# Altium schematic sheet 11 MISC.SchDoc
size 420 x 297 mm
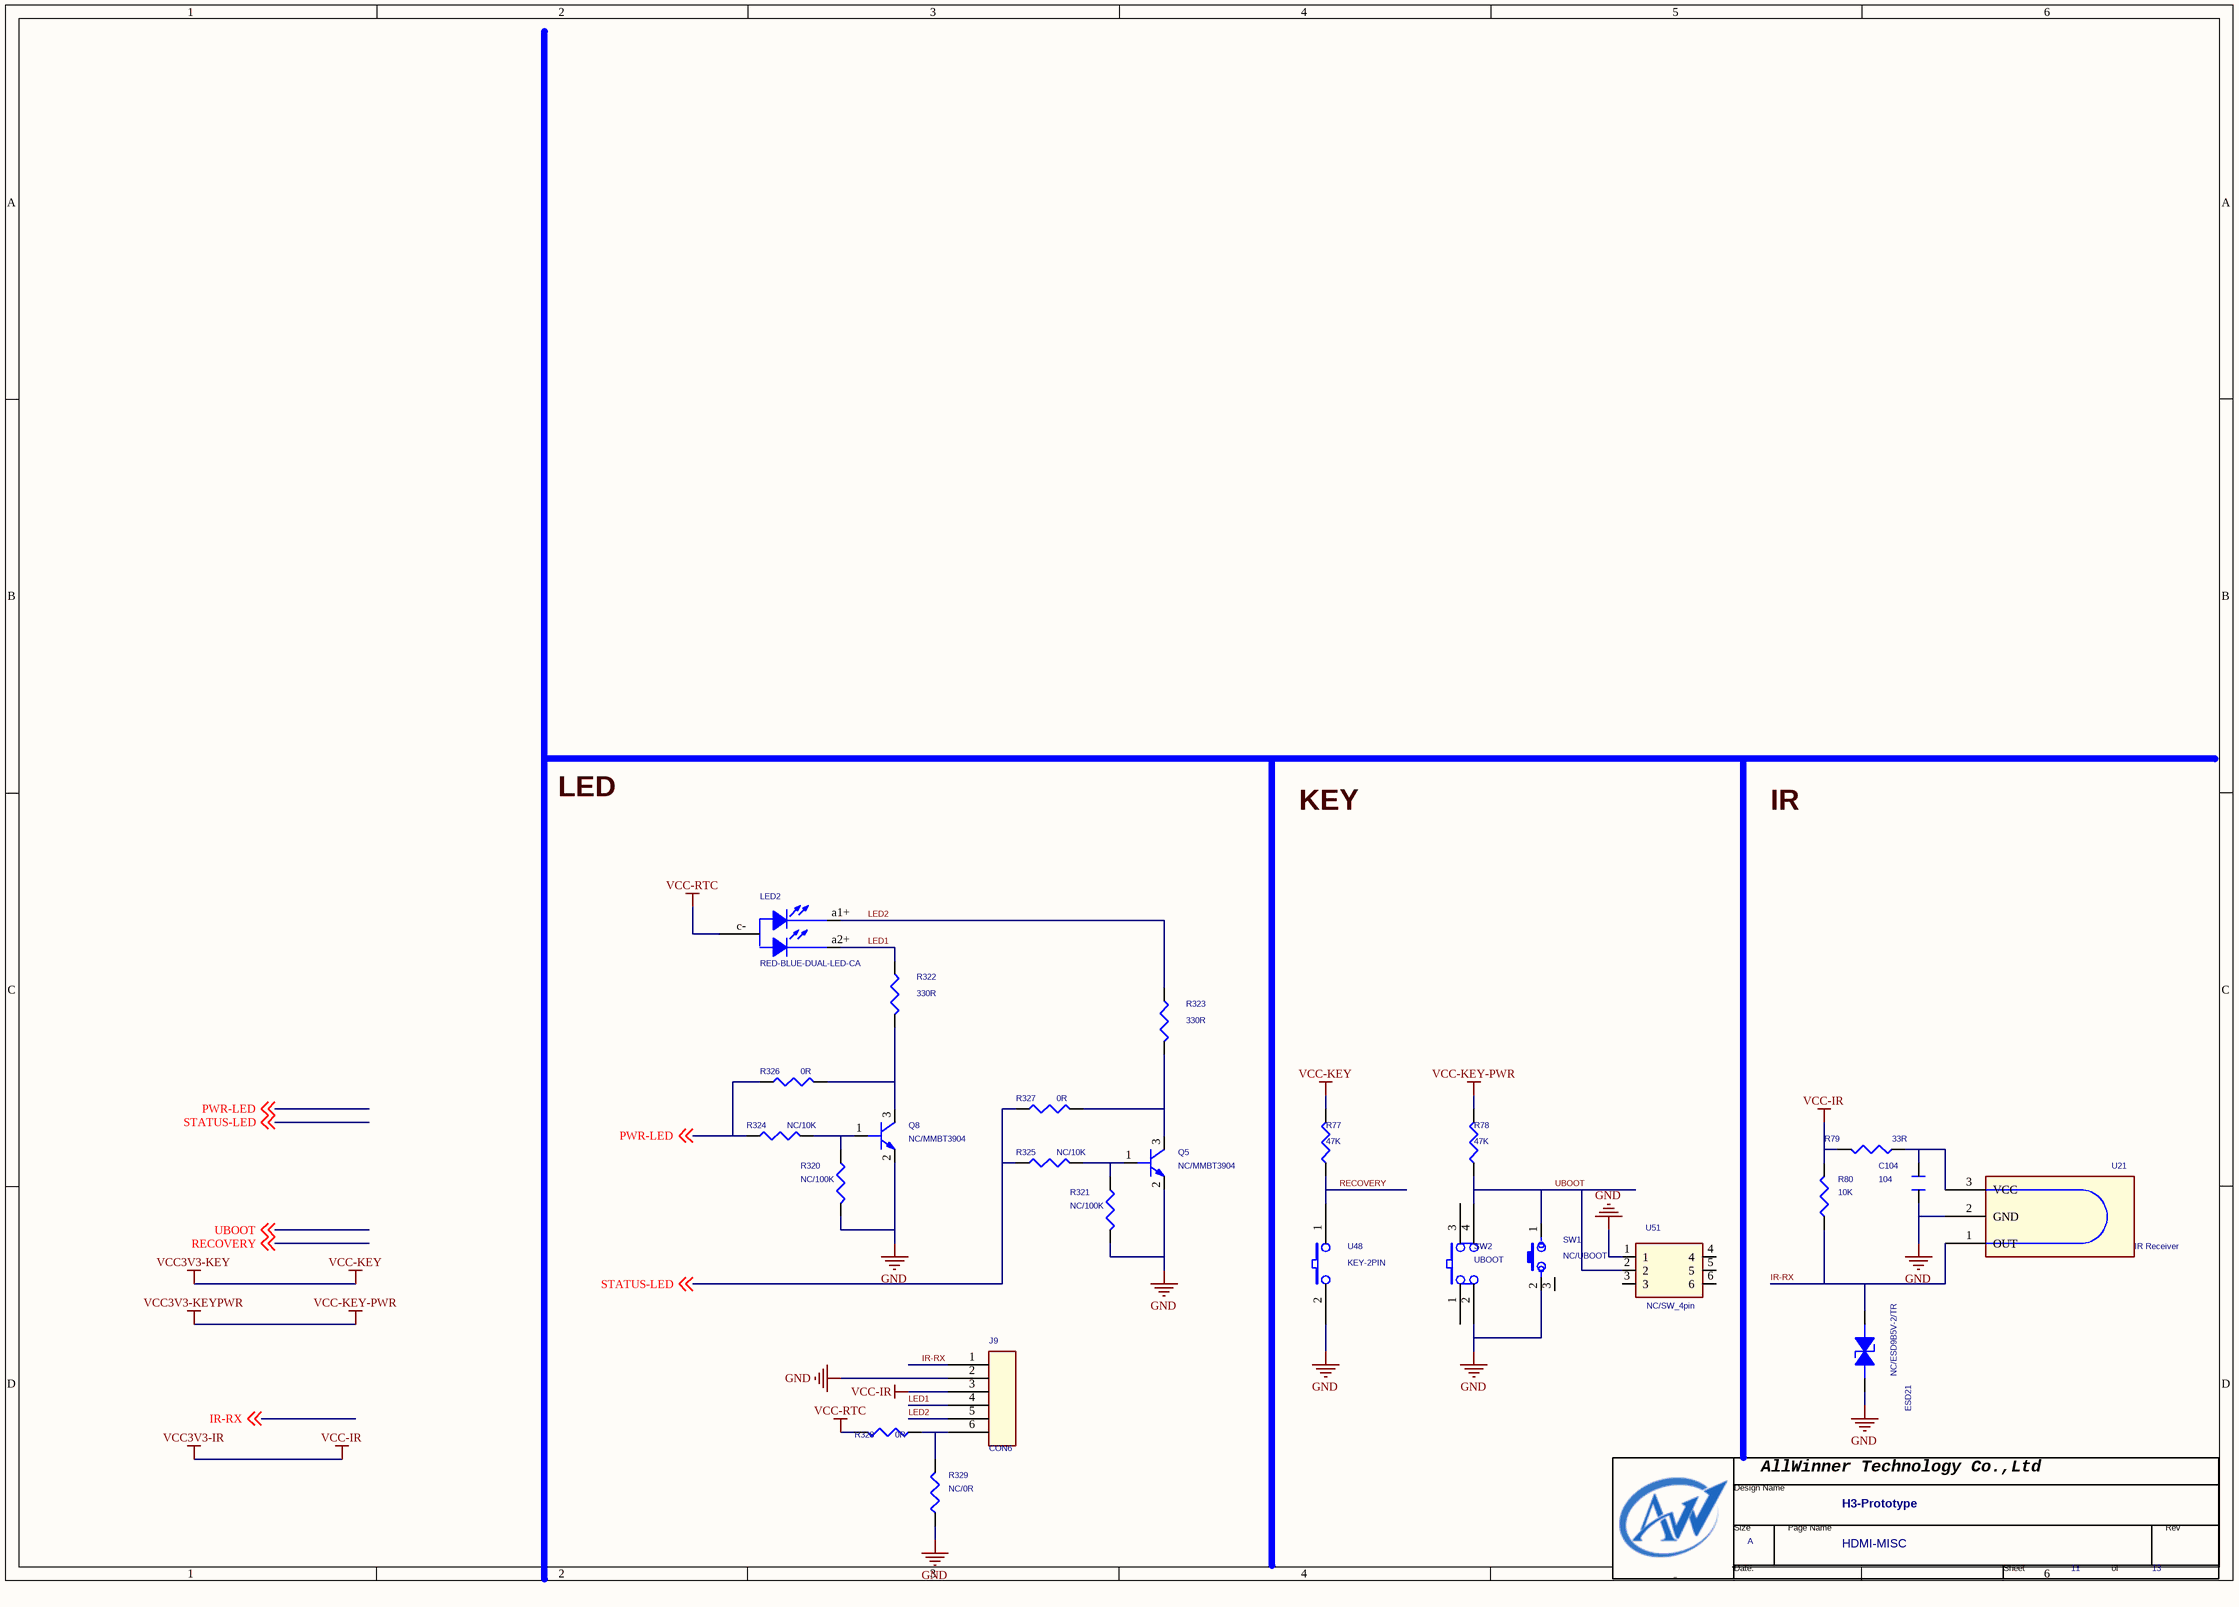
[diagram p0: 11 MISC.SchDoc]

## Parts
*  Page Count: 13  Page Number: 11  Page Size: A  Title: H3-Prototype  Doc: HDMI-MISC  (hidden comment: TitleBlock0-AW)  (graphical)
C104  104  [C0402]
ESD21  NC/ESD9B5V-2/TR  [tvs0402]
J9  CON6  [HDR6P2_00]
LED2  RED-BLUE-DUAL-LED-CA  [led3p2_4b8_1x12_1]
Q5  NC/MMBT3904  [SOT-23]
Q8  NC/MMBT3904  [SOT-23]
R77  47K  [0805]
R78  47K  [0805]
R79  33R  [R0402]
R80  10K  [R0402]
R320  NC/100K  [R0402]
R321  NC/100K  [R0402]
R322  330R  [R0402]
R323  330R  [R0402]
R324  NC/10K  [R0402]
R325  NC/10K  [R0402]
R326  0R  [R0402]
R327  0R  [R0402]
R328  0R  [R0402]
R329  NC/0R  [R0402]
SW1  NC/UBOOT  [KEY0.3]
SW2  UBOOT  [SW4]
U21  IR_MODULE  [IR3P2_50B7_00X3_50]  (value not drawn)
U48  KEY-2PIN  [SW3X4_2P]
U51  NC/SW_4pin  [KEY6P3_40]

## Nets
GND: C104.1 ESD21.2(CATHODE) J9.2 Q5.2(E) Q8.2(E) R320.2 R321.2 R329.1 SW1.2 SW2.2 U21.2(GND) U48.2 U51.1
VCC-IR: J9.3 R79.2 R80.2  [also labelled VCC3V3-IR]
VCC-KEY: R77.2  [also labelled VCC3V3-KEY]
VCC-KEY-PWR: R78.2  [also labelled VCC3V3-KEYPWR]
VCC-RTC: LED2.c- R328.2
IR-RX: ESD21.1(ANODE) J9.1 R80.1 U21.1(OUT) ; off-sheet IR-RX
LED1: J9.4 LED2.a2+ R322.1
LED2: J9.5 LED2.a1+ R323.1
PWR-LED: R324.1 R326.1 ; off-sheet PWR-LED
RECOVERY: R77.1 U48.1 ; off-sheet RECOVERY
STATUS-LED: R325.1 R327.1 ; off-sheet STATUS-LED
UBOOT: R78.1 SW1.1 SW2.4 U51.2 ; off-sheet UBOOT
NetC104_2: C104.2 R79.1 U21.3(VCC)
NetJ9_6: J9.6 R328.1 R329.2
NetQ5_1: Q5.1(B) R321.1 R325.2
NetQ5_3: Q5.3(C) R323.2 R327.2
NetQ8_1: Q8.1(B) R320.1 R324.2
NetQ8_3: Q8.3(C) R322.2 R326.2

Not connected (* = marked no-connect by the designer): SW1 3; SW2 1 3; U51 3 4 5 6

## Notes on the sheet
- LED
- KEY
- IR
- (in symbol IR_Module_0) IR Receiver
- (in symbol TitleBlock0-AW) AllWinner Technology Co.,Ltd; Design Name; Size; Page Name; Rev; Date:; Sheet; of

## Library data of the parts
C104 = CAPACITOR_0_Dup5
ESD21 = 1_1.5KE100A: 1ST PART DESCRIPTION: WILL ESD9B5V Bidirection ESD Protection
J9 = CON2_2
LED2 = LED_1
Q5 Q8 = NPN
R77 R78 = R1 0805_Dup2
R79 R80 R328 R329 = R_Dup3
R320-R327 = R
SW1 = SW-_0
SW2 = SW_PUSH: SDTSourceLibName: C:\WIND95\TEMP\6200.LIB
U21 = IR_Module_0
U48 = KEY-2PIN: SDTSourceLibName: C:\WIND95\TEMP\6200.LIB
U51 = SW_4pin
* = TitleBlock0-AW: Page Create Date: March  8, 1995